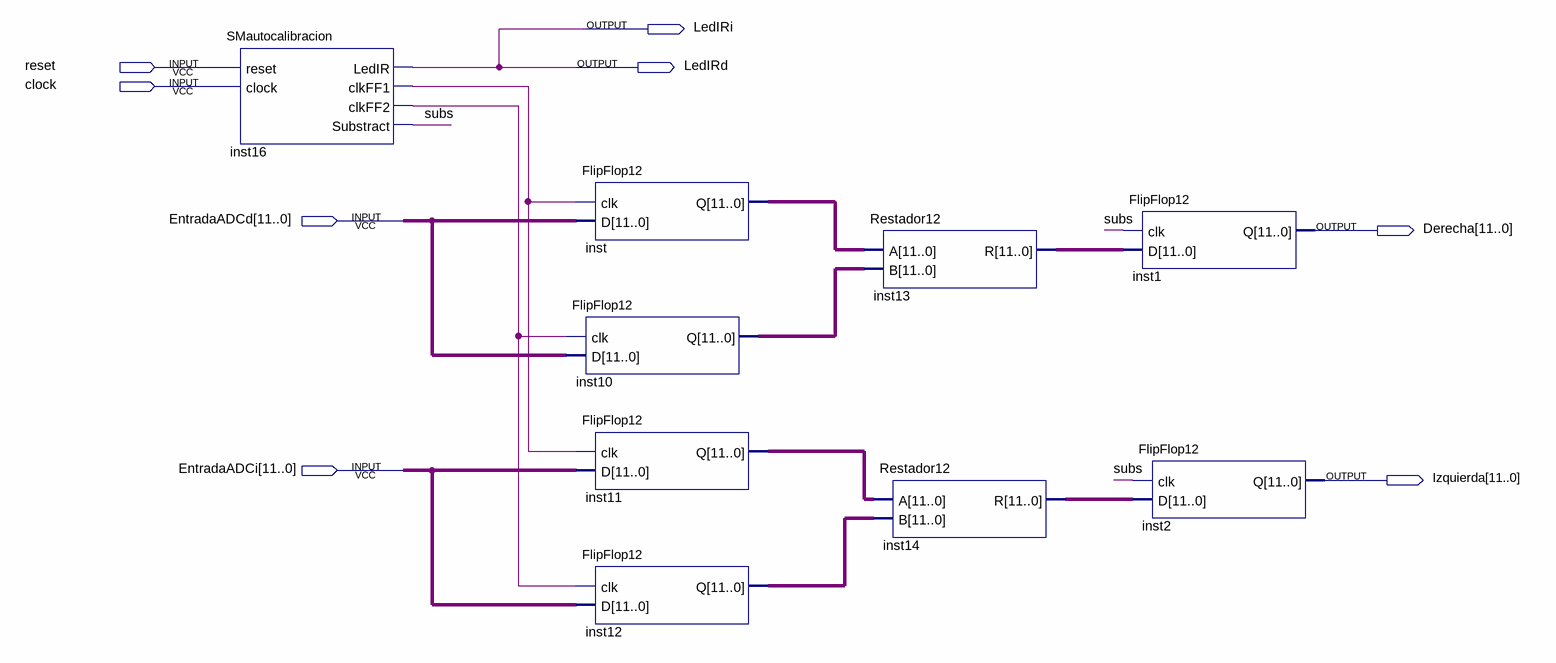
[diagram p0: schematic sheet]
// Quartus schematic Calculador_ADCs.bdf as structural Verilog: 9 symbols, 8 pins
module Calculador_ADCs (
  input  reset,
  input  clock,
  input  [11:0] EntradaADCd,
  input  [11:0] EntradaADCi,
  output LedIRi,
  output LedIRd,
  output [11:0] Derecha,
  output [11:0] Izquierda
);

  wire inst16_clkff1, inst16_clkff2, subs;
  wire [11:0] inst10_q, inst11_q, inst12_q, inst13_r, inst14_r, inst_q;

  SMautocalibracion inst16 (
    .reset(reset), .clock(clock), .LedIR(LedIRd), .clkFF1(inst16_clkff1), .clkFF2(inst16_clkff2),
    .Substract(subs));
  FlipFlop12 inst10 (.clk(inst16_clkff2), .D(EntradaADCd), .Q(inst10_q));
  FlipFlop12 inst (.clk(inst16_clkff1), .D(EntradaADCd), .Q(inst_q));
  FlipFlop12 inst11 (.clk(inst16_clkff1), .D(EntradaADCi), .Q(inst11_q));
  FlipFlop12 inst12 (.clk(inst16_clkff2), .D(EntradaADCi), .Q(inst12_q));
  Restador12 inst13 (.A(inst_q), .B(inst10_q), .R(inst13_r));
  Restador12 inst14 (.A(inst11_q), .B(inst12_q), .R(inst14_r));
  FlipFlop12 inst1 (.clk(subs), .D(inst13_r), .Q(Derecha));
  FlipFlop12 inst2 (.clk(subs), .D(inst14_r), .Q(Izquierda));

  assign LedIRi = LedIRd;
endmodule
